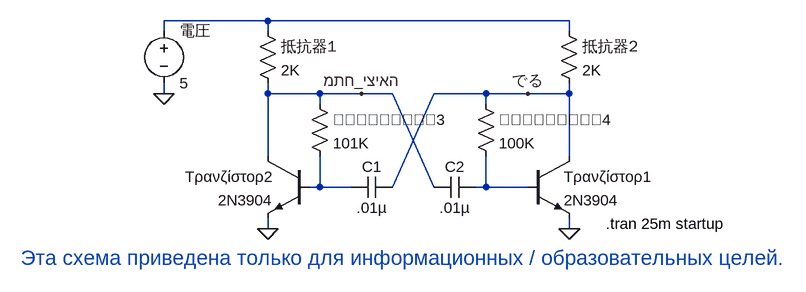
[diagram p0: schematic UNICODE.asc]
UNICODE.asc, the LTspice schematic file:
Version 4
SHEET 1 888 1240
WIRE -560 768 -720 768
WIRE -96 768 -560 768
WIRE -720 784 -720 768
WIRE -560 784 -560 768
WIRE -96 784 -96 768
WIRE -720 880 -720 864
WIRE -560 880 -560 864
WIRE -480 880 -560 880
WIRE -416 880 -480 880
WIRE -368 880 -416 880
WIRE -224 880 -304 880
WIRE -160 880 -224 880
WIRE -96 880 -96 864
WIRE -96 880 -160 880
WIRE -480 896 -480 880
WIRE -224 896 -224 880
WIRE -560 976 -560 880
WIRE -96 976 -96 880
WIRE -480 1024 -480 976
WIRE -480 1024 -496 1024
WIRE -432 1024 -480 1024
WIRE -368 1024 -304 880
WIRE -304 1024 -368 880
WIRE -224 1024 -224 976
WIRE -224 1024 -240 1024
WIRE -160 1024 -224 1024
WIRE -560 1088 -560 1072
WIRE -96 1088 -96 1072
FLAG -96 1088 0
FLAG -560 1088 0
FLAG -720 880 0
FLAG -160 880 でる
FLAG -416 880 מתח_יציאה
SYMBOL RES -576 768 R0
SYMATTR InstName 抵抗器1
SYMATTR Value 2K
SYMBOL res -112 768 R0
SYMATTR InstName 抵抗器2
SYMATTR Value 2K
SYMBOL res -496 880 R0
SYMATTR InstName रोकनेवाला3
SYMATTR Value 101K
SYMBOL res -240 880 R0
SYMATTR InstName रोकनेवाला4
SYMATTR Value 100K
SYMBOL cap -368 1008 R90
WINDOW 0 0 32 VBottom 2
WINDOW 3 32 32 VTop 2
SYMATTR InstName C1
SYMATTR Value .01µ
SYMBOL cap -240 1008 R90
WINDOW 0 0 32 VBottom 2
WINDOW 3 32 32 VTop 2
SYMATTR InstName C2
SYMATTR Value .01µ
SYMBOL VOLTAGE -720 768 R0
SYMATTR InstName 電圧
SYMATTR Value 5
SYMBOL NPN -160 976 R0
SYMATTR InstName Τρανζίστορ1
SYMATTR Value 2N3904
SYMBOL npn -496 976 M0
SYMATTR InstName Τρανζίστορ2
SYMATTR Value 2N3904
TEXT -40 1080 Left 2 !.tran 25m startup
TEXT -352 1112 Top 3 ;Эта схема приведена только для информационных / образовательных целей.

The netlist it stands for:
* UNICODE.asc
R§抵抗器1 N001 מתח_יציאה 2K
R§抵抗器2 N001 でる 2K
R§रोकनेवाला3 מתח_יציאה N002 101K
R§रोकनेवाला4 でる N003 100K
C1 でる N002 .01µ
C2 N003 מתח_יציאה .01µ
V§電圧 N001 0 5
Q§Τρανζίστορ1 でる N003 0 0 2N3904
Q§Τρανζίστορ2 מתח_יציאה N002 0 0 2N3904
.model NPN NPN
.model PNP PNP
.lib standard.bjt
.tran 25m startup
* Эта схема приведена только для информационных / образовательных целей.
.backanno
.end